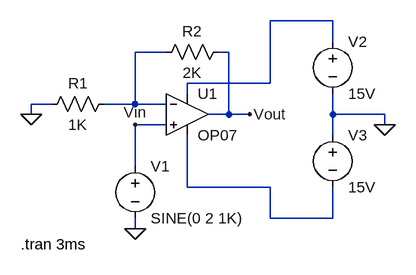
[diagram p0: schematic Non Inverting Amplifier.asc]
Non Inverting Amplifier.asc, the LTspice schematic file:
Version 4
SHEET 1 880 680
WIRE 432 16 336 16
WIRE 432 48 432 16
WIRE 176 64 128 64
WIRE 272 64 256 64
WIRE 336 112 336 16
WIRE 336 112 208 112
WIRE 208 128 208 112
WIRE 0 144 -32 144
WIRE 128 144 128 64
WIRE 128 144 80 144
WIRE 176 144 128 144
WIRE -32 160 -32 144
WIRE 272 160 272 64
WIRE 272 160 240 160
WIRE 304 160 272 160
WIRE 432 160 432 128
WIRE 512 160 432 160
WIRE 176 176 128 176
WIRE 512 176 512 160
WIRE 432 192 432 160
WIRE 128 240 128 176
WIRE 208 272 208 192
WIRE 336 272 208 272
WIRE 336 320 336 272
WIRE 432 320 432 272
WIRE 432 320 336 320
WIRE 128 336 128 320
FLAG -32 160 0
FLAG 128 336 0
FLAG 512 176 0
FLAG 128 176 Vin
FLAG 304 160 Vout
SYMBOL OpAmps\\OP07 208 96 R0
SYMATTR InstName U1
SYMBOL res 96 128 R90
WINDOW 0 0 56 VBottom 2
WINDOW 3 32 56 VTop 2
SYMATTR InstName R1
SYMATTR Value 1K
SYMBOL res 272 48 R90
WINDOW 0 0 56 VBottom 2
WINDOW 3 32 56 VTop 2
SYMATTR InstName R2
SYMATTR Value 2K
SYMBOL voltage 128 224 R0
WINDOW 123 0 0 Left 0
WINDOW 39 0 0 Left 0
SYMATTR InstName V1
SYMATTR Value SINE(0 2 1K)
SYMBOL voltage 432 32 R0
SYMATTR InstName V2
SYMATTR Value 15V
SYMBOL voltage 432 176 R0
SYMATTR InstName V3
SYMATTR Value 15V
TEXT -48 360 Left 2 !.tran 3ms

The netlist it stands for:
* Non Inverting Amplifier.asc
XU1 Vin N002 N001 N003 Vout LT1001  ; OP07, pins In+ In- V+ V- OUT
R1 N002 0 1K
R2 Vout N002 2K
V1 Vin 0 SINE(0 2 1K)
V2 N001 0 15V
V3 0 N003 15V
.tran 3ms
.lib LTC.lib
.backanno
.end